# EAGLE design W070djg (EAGLE 6.6.0)
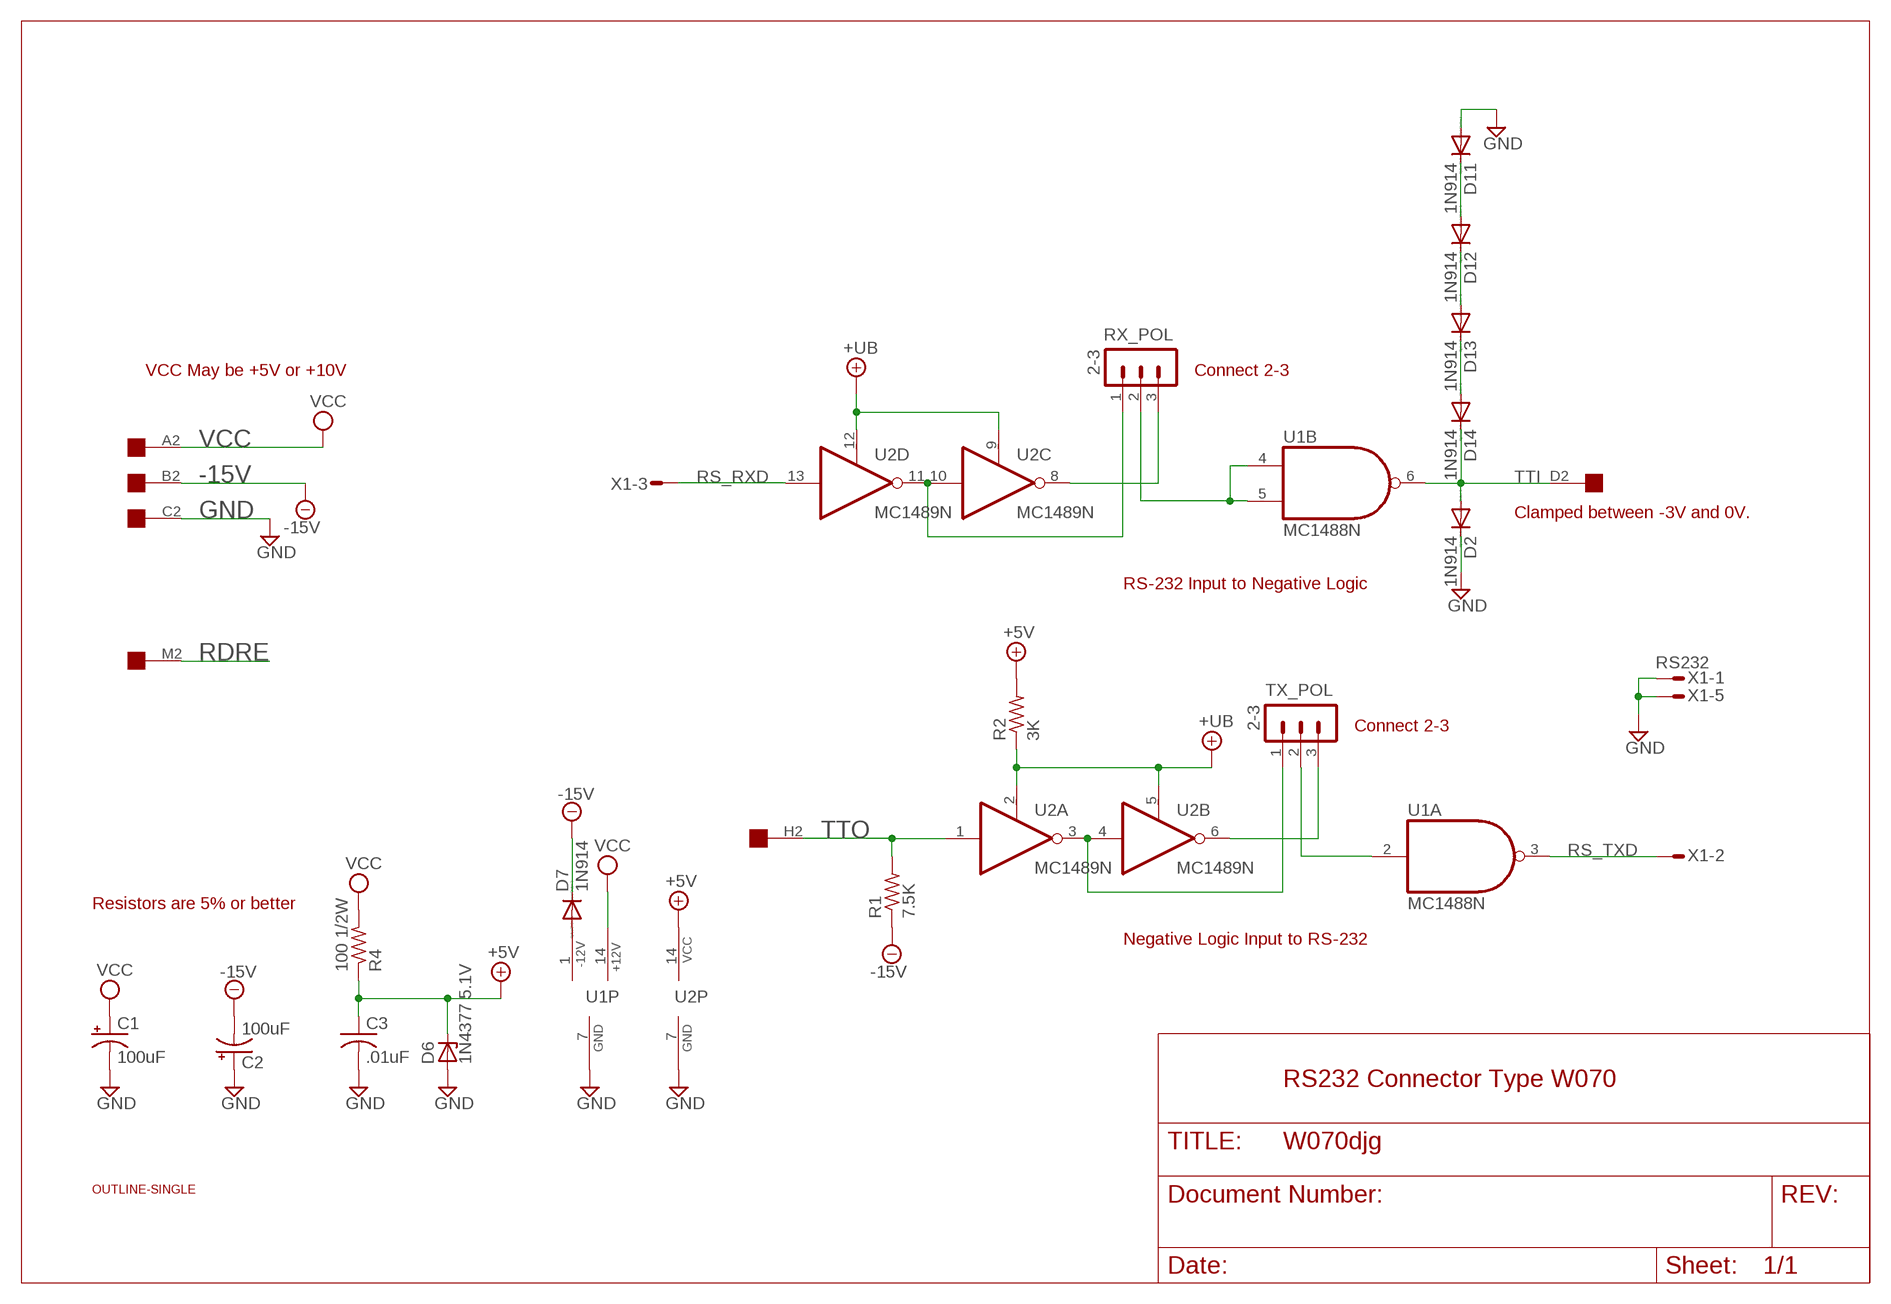
[diagram p0: schematic, sheet 1]

## Parts
C1  100uF  CPOL-USE22-9AXIAL  [E22-9]
C2  100uF  CPOL-USE22-9AXIAL  [E22-9]
C3  .01uF  C-US050-025X075  [C050-025X075]
D2  1N914  1N4148DO35-10  [DO35-10]
D6  1N4377 5.1V  ZENER-DIODEDO35Z10  [DO35Z10]
D7  1N914  1N4148DO35-10  [DO35-10]
D11  1N914  1N4148DO35-10  [DO35-10]
D12  1N914  1N4148DO35-10  [DO35-10]
D13  1N914  1N4148DO35-10  [DO35-10]
D14  1N914  1N4148DO35-10  [DO35-10]
EDGE  EDGE-1  [EDGE-CON1]
R1  7.5K  R-US_0207/10  [0207/10]
R2  3K  R-US_0207/10  [0207/10]
R4  100 1/2W  R-US_0309/12  [0309/12]
RX_POL  2-3  MA03-1  [MA03-1]
TX_POL  2-3  MA03-1  [MA03-1]
U1  MC1488N  1488N  [DIL14]
U2  MC1489N  1489N  [DIL14]
U$1  OUTLINE-SINGLE  [SINGLE]
X1  RS232  M09-182S  [182-009-MALE]

## Nets
+5V: C3.1 D6.C R2.2 R4.1 U2.14(P:VCC)
+UB: R2.1 U2.2(A:RC) U2.5(B:RC) U2.9(C:RC) U2.12(D:RC)
-12V: D7.A U1.1(P:-12V)
-15V: C2.- D7.C EDGE.B2 R1.1
GND: C1.- C2.+ C3.2 D2.C D6.A D11.A EDGE.C2 U1.7(P:GND) U2.7(P:GND) X1.1 X1.5
N$2: TX_POL.1 U2.3(A:O) U2.4(B:I)
N$3: D13.C D14.A
N$4: D12.C D13.A
N$5: D11.C D12.A
N$6: TX_POL.3 U2.6(B:O)
N$7: TX_POL.2 U1.2(A:I)
N$8: RX_POL.1 U2.10(C:I) U2.11(D:O)
N$9: RX_POL.2 U1.4(B:I0) U1.5(B:I1)
N$13: RX_POL.3 U2.8(C:O)
RDRE: EDGE.M2
RS_RXD: U2.13(D:I) X1.3
RS_TXD: U1.3(A:O) X1.2
TTI: D2.A D14.C EDGE.D2 U1.6(B:O)
TTO: EDGE.H2 R1.2 U2.1(A:I)
VCC: C1.+ EDGE.A2 R4.2 U1.14(P:+12V)
Unconnected: EDGE.E2 EDGE.F2 EDGE.J2 EDGE.K2 EDGE.L2 EDGE.N2 EDGE.P2 EDGE.R2 EDGE.S2 EDGE.T2 EDGE.U2 EDGE.V2 U1.8(C:O) U1.9(C:I0) U1.10(C:I1) U1.11(D:O) U1.12(D:I0) U1.13(D:I1) X1.4 X1.6 X1.7 X1.8 X1.9

## Notes on the sheet
- VCC May be +5V or +10V | Connect 2-3
- Clamped between -3V and 0V.
- RS-232 Input to Negative Logic
- Connect 2-3
- Resistors are 5% or better
- Negative Logic Input to RS-232
- RS232 Connector Type W070

## Library data of the parts
C1 C2 = rcl:CPOL-US: POLARIZED CAPACITOR, American symbol
C3 = rcl:C-US: CAPACITOR, American symbol
D2 D7 D11-D14 = diode:1N4148: DIODE high speed (Philips)
D6 = diode:ZENER-DIODE: Z-Diode
EDGE = dec-con:EDGE-1: Single-Sided DEC Edge Connector -- (side 2)
R1 R2 R4 = rcl:R-US_: RESISTOR, American symbol
RX_POL TX_POL = con-lstb:MA03-1: PIN HEADER; OC_FARNELL: unknown; OC_NEWARK: unknown
U1 = dec-con:14*88: Quad 2-input NAND gate
U2 = dec-con:14*89: Quad line receivers BUFFER,
U$1 = dec-con:OUTLINE-*: Board outlines for DEC boards.
X1 = con-subd:M09?S: SUB-D; OC_FARNELL: unknown; OC_NEWARK: unknown

## Board
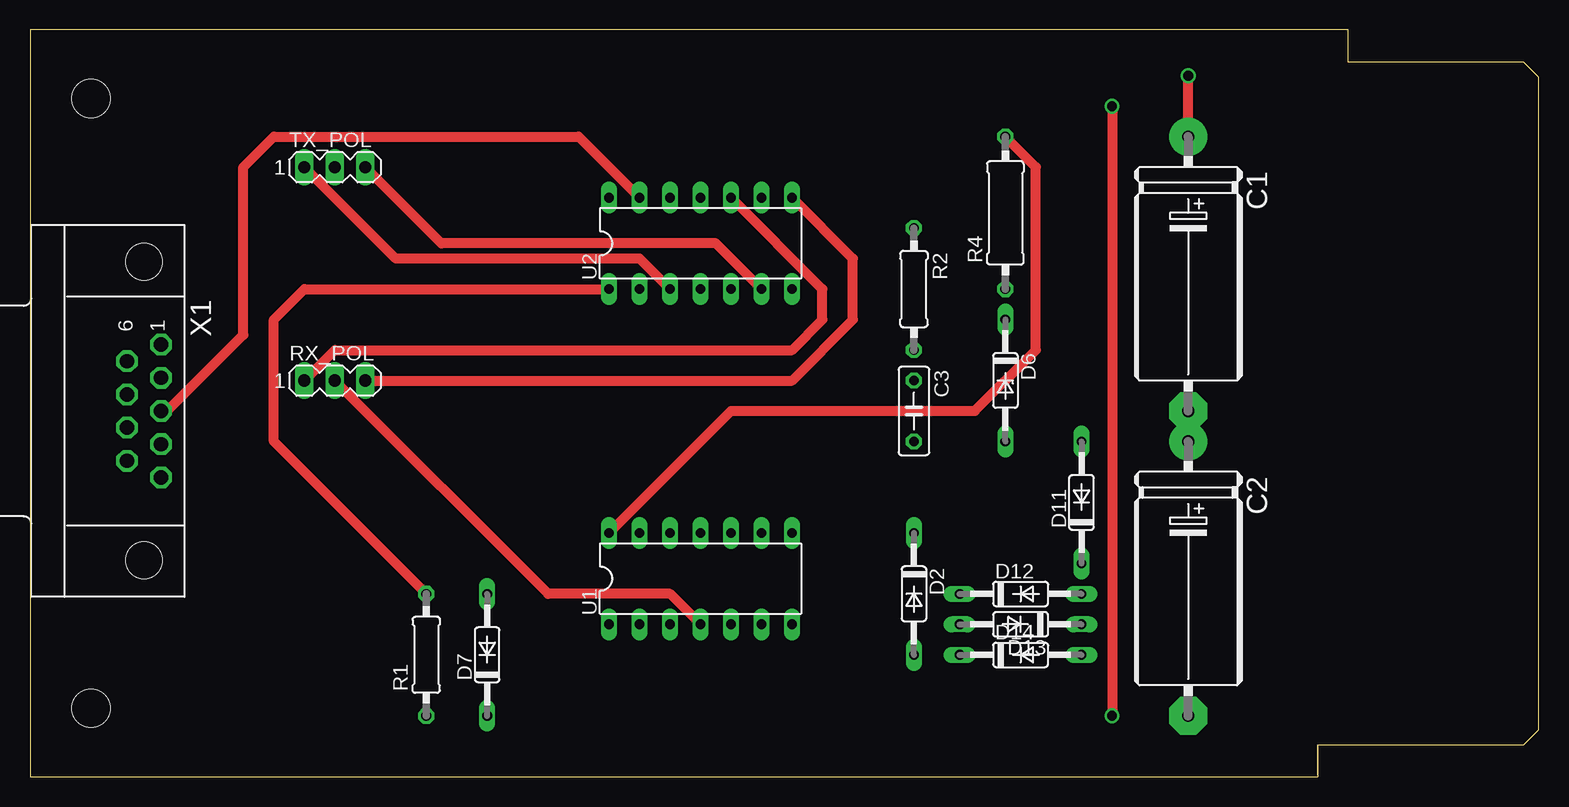
[diagram p1: board, top side]
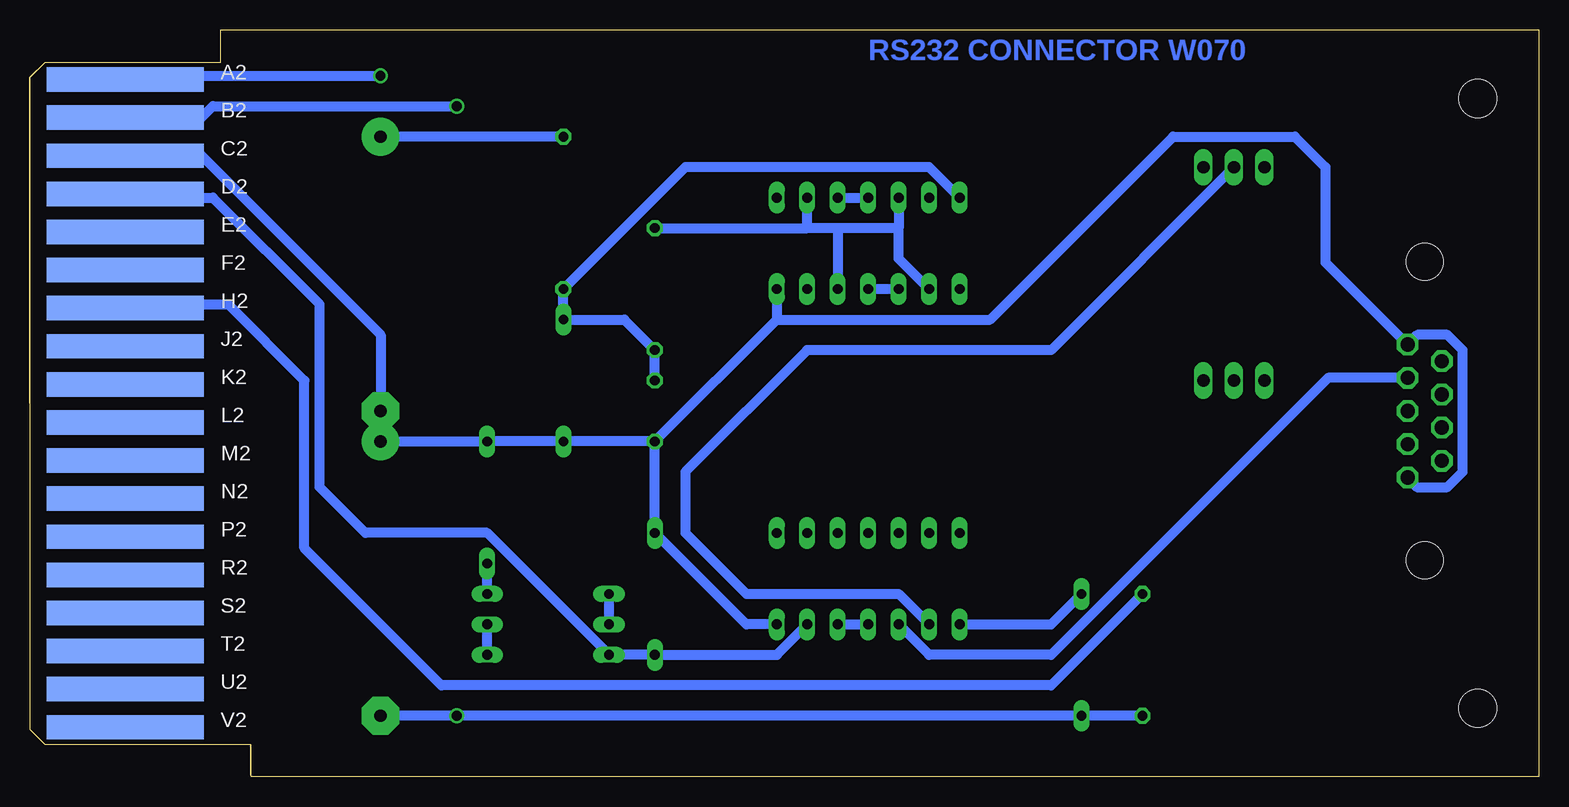
[diagram p2: board, bottom side, seen from below]

Size 125.73 x 62.23 mm. Coordinates in mm from the lower left corner, seen from the top.
Copper layers (1+16): Top 0.035mm / dielectric 1.5mm / Bottom 0.035mm
Design rules "16mils": minimum track width 16mil, minimum drill 32mil, track to track 15mil, track to pad 10mil, pad to pad 10mil, via to via 10mil, smd to smd 10mil, copper to edge 13mil, drill to drill 10mil, minimum pad ring 10mil, minimum via ring 8mil, stop-mask expansion 0mil, vias tented up to drill 0mil, thermal gap 10mil

### Footprints (pad centres in the part's own frame; a part is rotated, then mirrored left to right if it is on the bottom)
E22-9 = drill 1.016 pad 3.15: + -11.43,0 | drill 1.016 pad 3.15 octagon: - 11.43,0
C050-025X075 = drill 0.813 octagon: 1 -2.54,0; 2 2.54,0
DO35-10 = drill 0.813 long: A 5.08,0; C -5.08,0
DO35Z10 = drill 0.813 long: A 5.08,0; C -5.08,0
EDGE-CON1 = smd 13.106 x 2.032 bottom: A2 7.938,4.128; B2 7.938,7.303; C2 7.938,10.477; D2 7.938,13.652; E2 7.938,16.828; F2 7.938,20.003; H2 7.938,23.177; J2 7.938,26.352; K2 7.938,29.527; L2 7.938,32.703; M2 7.938,35.877; N2 7.938,39.053; P2 7.938,42.227; R2 7.938,45.403; S2 7.938,48.578; T2 7.938,51.752; U2 7.938,54.928; V2 7.938,58.102
0207/10 = drill 0.813 octagon: 1 -5.08,0; 2 5.08,0
0309/12 = drill 0.813 octagon: 1 -6.35,0; 2 6.35,0
MA03-1 = drill 1.016 long: 1 -2.54,0; 2 0,0; 3 2.54,0
DIL14 = drill 0.813 long: 1 -7.62,-3.81; 2 -5.08,-3.81; 3 -2.54,-3.81; 4 0,-3.81; 5 2.54,-3.81; 6 5.08,-3.81; 7 7.62,-3.81; 8 7.62,3.81; 9 5.08,3.81; 10 2.54,3.81; 11 0,3.81; 12 -2.54,3.81; 13 -5.08,3.81; 14 -7.62,3.81
SINGLE = hole 3.175: 120.65,56.515; 120.65,5.715
182-009-MALE = drill 1.194 pad 1.524 octagon: 1 -5.537,10.923; 2 -2.769,10.923; 3 0,10.923; 4 2.769,10.923; 5 5.537,10.923; 6 -4.153,8.08; 7 -1.384,8.08; 8 1.384,8.08; 9 4.153,8.08 | hole 3.048: -12.446,9.501; 12.446,9.501

### Placement (x,y rotation side)
C1  96.52,41.91 270 top
C2  96.52,16.51 270 top
C3  73.66,30.48 270 top
D2  73.66,15.24 270 top
D6  81.28,33.02 270 top
D7  38.1,10.16 90 top
D11  87.63,22.86 90 top
D12  82.55,15.24 0 top
D13  82.55,12.7 180 top
D14  82.55,10.16 0 top
EDGE  125.73,62.23 180 top
R1  33.02,10.16 90 top
R2  73.66,40.64 270 top
R4  81.28,46.99 90 top
RX_POL  25.4,33.02 0 top
TX_POL  25.4,50.8 0 top
U1  55.88,16.51 0 top
U2  55.88,44.45 0 top
U$1  125.73,62.23 180 top
X1  0,30.48 270 top

### Tracks (layer width: path | path; a pad name or v marks a point on that pad's centre or on a via)
+5V
  Bottom 0.813: C3.1 R2.2 76.2,38.1 D6.C R4.1 71.12,50.8 50.8,50.8 U2.14
+UB
  Bottom 0.813: R2.1 60.96,45.72 | 60.96,45.72 U2.9 | 58.42,45.72 U2.5 | U2.12 53.34,45.72 | 53.34,45.72 58.42,45.72 | 58.42,45.72 60.96,45.72 | U2.2 53.34,43.18 53.34,45.72
-12V
  Bottom 0.813: U1.1 40.64,12.7 D7.A
-15V  (via drill 0.81)
  Top 0.813: v90.17,55.88 v90.17,5.08
  Bottom 0.813: R1.1 D7.C v90.17,5.08 C2.- | EDGE.B2 117.16,54.93 116.84,54.61 111.76,54.61 110.49,55.88 v90.17,55.88
GND
  Bottom 0.813: EDGE.C2 117.16,51.75 116.84,52.07 111.76,52.07 96.52,36.83 C1.- C2.+ D11.A D6.A C3.2 | C3.2 D2.C 66.04,12.7 U1.7 | U2.7 63.5,38.1 | 63.5,38.1 C3.2 | 63.5,38.1 45.72,38.1 30.48,53.34 20.32,53.34 17.78,50.8 17.78,42.87 X1.1 10.11,36.83 7.62,36.83 6.35,35.56 6.35,25.4 7.62,24.13 10.16,24.13 10.92,24.89 X1.5
N$2
  Top 0.813: U2.3 50.8,43.18 30.48,43.18 TX_POL.1
  Bottom 0.813: U2.3 U2.4
N$3
  Bottom 0.813: D14.A D13.C
N$4
  Bottom 0.813: D13.A D12.C
N$5
  Bottom 0.813: D12.A D11.C
N$6
  Top 0.813: U2.6 57.15,44.45 34.29,44.45 TX_POL.3
N$7
  Bottom 0.813: TX_POL.2 40.64,35.56 60.96,35.56 71.12,25.4 71.12,20.32 66.04,15.24 53.34,15.24 U1.2
N$8
  Top 0.813: RX_POL.1 25.4,35.56 63.5,35.56 66.04,38.1 66.04,40.64 U2.10
  Bottom 0.813: U2.10 U2.11
N$9
  Top 0.813: U1.4 53.34,15.24 43.18,15.24 RX_POL.2
  Bottom 0.813: U1.5 U1.4
N$13
  Top 0.813: RX_POL.3 63.5,33.02 68.58,38.1 68.58,43.18 U2.8
RS_RXD
  Top 0.813: X1.3 11.43,30.48 17.78,36.83 17.78,50.8 20.32,53.34 45.72,53.34 U2.13
RS_TXD
  Bottom 0.813: X1.2 17.55,33.25 40.64,10.16 50.8,10.16 U1.3
TTI
  Bottom 0.813: U1.6 63.5,10.16 D2.A D14.C 87.63,20.32 97.79,20.32 101.6,24.13 101.6,39.37 110.49,48.26 116.84,48.26 117.16,48.58 EDGE.D2
TTO
  Top 0.813: R1.2 20.32,27.94 20.32,38.1 22.86,40.64 U2.1
  Bottom 0.813: R1.2 40.64,7.62 91.44,7.62 102.87,19.05 102.87,33.02 109.22,39.37 116.84,39.37 117.16,39.05 EDGE.H2
VCC  (via drill 0.81)
  Top 0.813: C1.+ v96.52,58.42 | U1.14 58.42,30.48 78.74,30.48 83.82,35.56 83.82,50.8 R4.2
  Bottom 0.813: R4.2 C1.+ | EDGE.A2 117.16,58.1 116.84,58.42 v96.52,58.42

### Text on the board
Bottom: RS232 CONNECTOR W070
200bmp: //wsl$/Debian/home/vrs/Eagle/projects/DEC/Wxxx/W070/W070djgfront.bmp